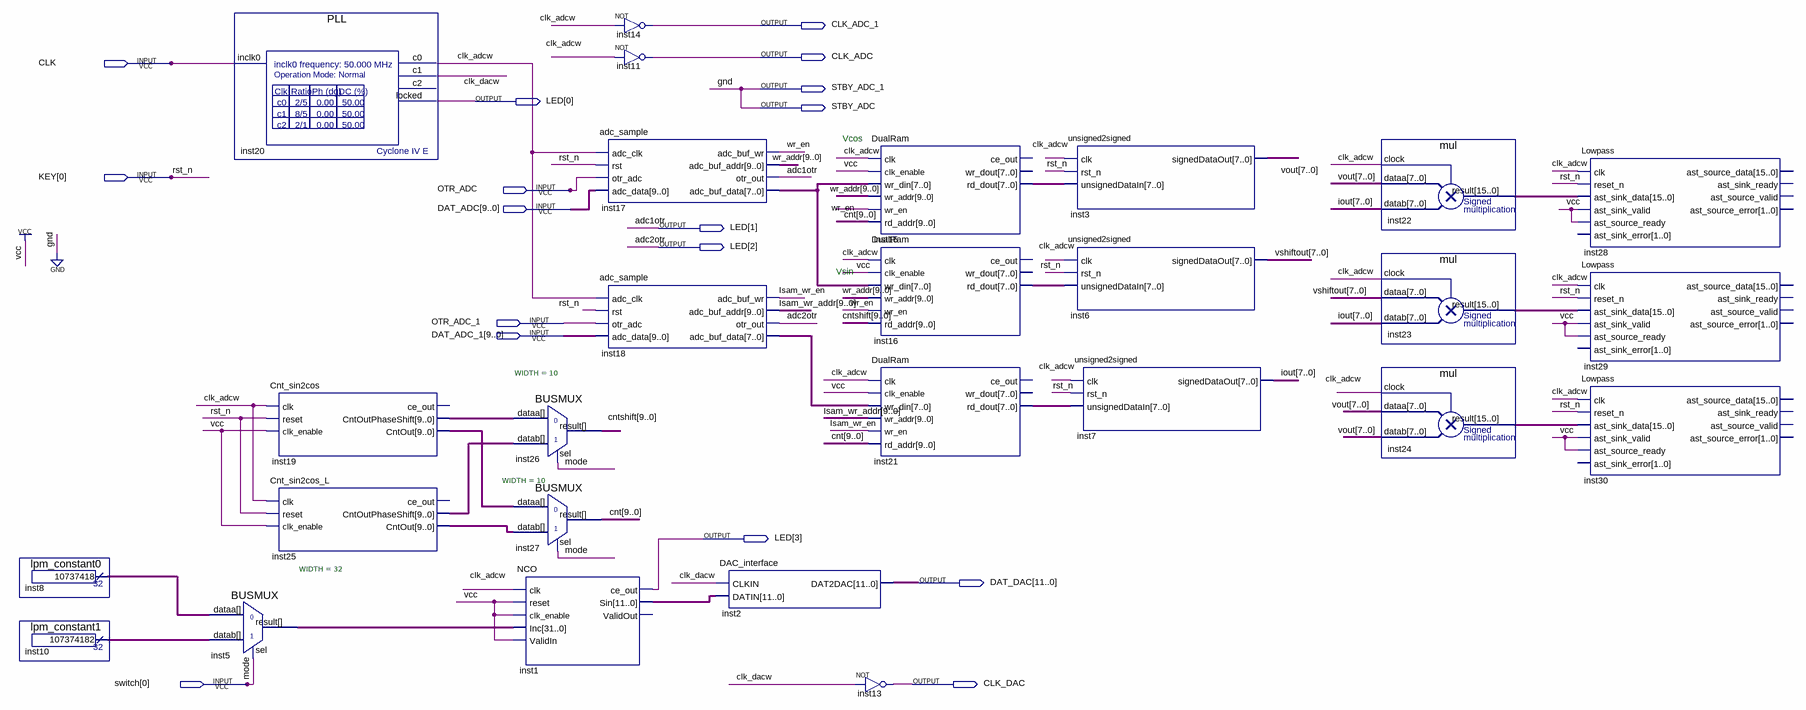
[diagram p0: schematic sheet]
// Quartus schematic adcdac_test.bdf as structural Verilog: 27 symbols, 17 pins
module adcdac_test (
  input  CLK,
  input  [0:0] KEY,
  input  OTR_ADC,
  input  [9:0] DAT_ADC,
  input  OTR_ADC_1,
  input  [9:0] DAT_ADC_1,
  input  [0:0] switch,
  output CLK_ADC_1,
  output CLK_ADC,
  output STBY_ADC_1,
  output [3:0] LED,
  output STBY_ADC,
  output [11:0] DAT_DAC,
  output CLK_DAC
);

  wire clk_adcw, clk_dacw, Isam_wr_en, wr_en;
  wire [7:0] inst15_rd_dout, inst16_rd_dout, inst17_adc_buf_data, inst18_adc_buf_data, inst21_rd_dout, iout,
       vout, vshiftout;
  wire [9:0] cnt, cntshift, inst19_cntout, inst19_cntoutphaseshift, inst25_cntout, inst25_cntoutphaseshift,
       Isam_wr_addr, wr_addr;
  wire [11:0] inst1_sin;
  wire [15:0] inst22_result, inst23_result, inst24_result;
  wire [31:0] inst5_result, inst8_result, inst10_result;

  lpm_constant0 inst8 (.result(inst8_result));
  lpm_constant1 inst10 (.result(inst10_result));
  PLL inst20 (.inclk0(CLK), .c0(clk_adcw), .c1(clk_dacw), .locked(LED[0]));  // open: c2
  BUSMUX #(.WIDTH(32)) inst5 (.datab(inst10_result), .sel(switch[0]), .dataa(inst8_result), .result(inst5_result));
  Cnt_sin2cos inst19 (
    .clk(clk_adcw), .reset(KEY[0]), .clk_enable(1'b1), .CntOutPhaseShift(inst19_cntoutphaseshift),
    .CntOut(inst19_cntout));  // open: ce_out
  Cnt_sin2cos_L inst25 (
    .clk(clk_adcw), .reset(KEY[0]), .clk_enable(1'b1), .CntOutPhaseShift(inst25_cntoutphaseshift),
    .CntOut(inst25_cntout));  // open: ce_out
  BUSMUX #(.WIDTH(10)) inst26 (
    .datab(inst25_cntoutphaseshift), .sel(switch[0]), .dataa(inst19_cntoutphaseshift), .result(cntshift));
  BUSMUX #(.WIDTH(10)) inst27 (.datab(inst25_cntout), .sel(switch[0]), .dataa(inst19_cntout), .result(cnt));
  NCO inst1 (
    .clk(clk_adcw), .reset(1'b1), .clk_enable(1'b1), .Inc(inst5_result), .ValidIn(1'b1), .ce_out(LED[3]),
    .Sin(inst1_sin));  // open: ValidOut
  adc_sample inst17 (
    .adc_clk(clk_adcw), .rst(KEY[0]), .otr_adc(OTR_ADC), .adc_data(DAT_ADC), .adc_buf_wr(wr_en),
    .adc_buf_addr(wr_addr), .otr_out(LED[1]), .adc_buf_data(inst17_adc_buf_data));
  adc_sample inst18 (
    .adc_clk(clk_adcw), .rst(KEY[0]), .otr_adc(OTR_ADC_1), .adc_data(DAT_ADC_1), .adc_buf_wr(Isam_wr_en),
    .adc_buf_addr(Isam_wr_addr), .otr_out(LED[2]), .adc_buf_data(inst18_adc_buf_data));
  not inst14 (CLK_ADC_1, clk_adcw);
  not inst11 (CLK_ADC, clk_adcw);
  DAC_interface inst2 (.CLKIN(clk_dacw), .DATIN(inst1_sin), .DAT2DAC(DAT_DAC));
  not inst13 (CLK_DAC, clk_dacw);
  DualRam inst15 (
    .clk(clk_adcw), .clk_enable(1'b1), .wr_din(inst17_adc_buf_data), .wr_addr(wr_addr), .wr_en(wr_en),
    .rd_addr(cnt), .rd_dout(inst15_rd_dout));  // open: ce_out, wr_dout
  DualRam inst16 (
    .clk(clk_adcw), .clk_enable(1'b1), .wr_din(inst17_adc_buf_data), .wr_addr(wr_addr), .wr_en(wr_en),
    .rd_addr(cntshift), .rd_dout(inst16_rd_dout));  // open: ce_out, wr_dout
  DualRam inst21 (
    .clk(clk_adcw), .clk_enable(1'b1), .wr_din(inst18_adc_buf_data), .wr_addr(Isam_wr_addr),
    .wr_en(Isam_wr_en), .rd_addr(cnt), .rd_dout(inst21_rd_dout));  // open: ce_out, wr_dout
  unsigned2signed inst3 (.clk(clk_adcw), .rst_n(KEY[0]), .unsignedDataIn(inst15_rd_dout), .signedDataOut(vout));
  unsigned2signed inst6 (.clk(clk_adcw), .rst_n(KEY[0]), .unsignedDataIn(inst16_rd_dout), .signedDataOut(vshiftout));
  unsigned2signed inst7 (.clk(clk_adcw), .rst_n(KEY[0]), .unsignedDataIn(inst21_rd_dout), .signedDataOut(iout));
  mul inst22 (.clock(clk_adcw), .dataa(vout), .datab(iout), .result(inst22_result));
  mul inst23 (.clock(clk_adcw), .dataa(vshiftout), .datab(iout), .result(inst23_result));
  mul inst24 (.clock(clk_adcw), .dataa(vout), .datab(vout), .result(inst24_result));
  Lowpass inst28 (
    .clk(clk_adcw), .reset_n(KEY[0]), .ast_sink_data(inst22_result), .ast_sink_valid(1'b1),
    .ast_source_ready(1'b1));  // open: ast_sink_error, ast_source_data, ast_sink_ready, ast_source_valid, ast_source_error
  Lowpass inst29 (
    .clk(clk_adcw), .reset_n(KEY[0]), .ast_sink_data(inst23_result), .ast_sink_valid(1'b1),
    .ast_source_ready(1'b1));  // open: ast_sink_error, ast_source_data, ast_sink_ready, ast_source_valid, ast_source_error
  Lowpass inst30 (
    .clk(clk_adcw), .reset_n(KEY[0]), .ast_sink_data(inst24_result), .ast_sink_valid(1'b1),
    .ast_source_ready(1'b1));  // open: ast_sink_error, ast_source_data, ast_sink_ready, ast_source_valid, ast_source_error

  assign STBY_ADC = 1'b0;
  assign STBY_ADC_1 = 1'b0;

  // Other names for the same wires on the sheet: adc1otr = LED[1]; adc2otr = LED[2]; rst_n = KEY[0]; mode = switch[0]

  // Notes on the sheet:
  //   Vcos
  //   Vsin
endmodule
